# Altium schematic sheet Power_Sheet.SchDoc (part 1 of 3)
size 420 x 297 mm; SheetNumber: 2; SheetTotal: 4
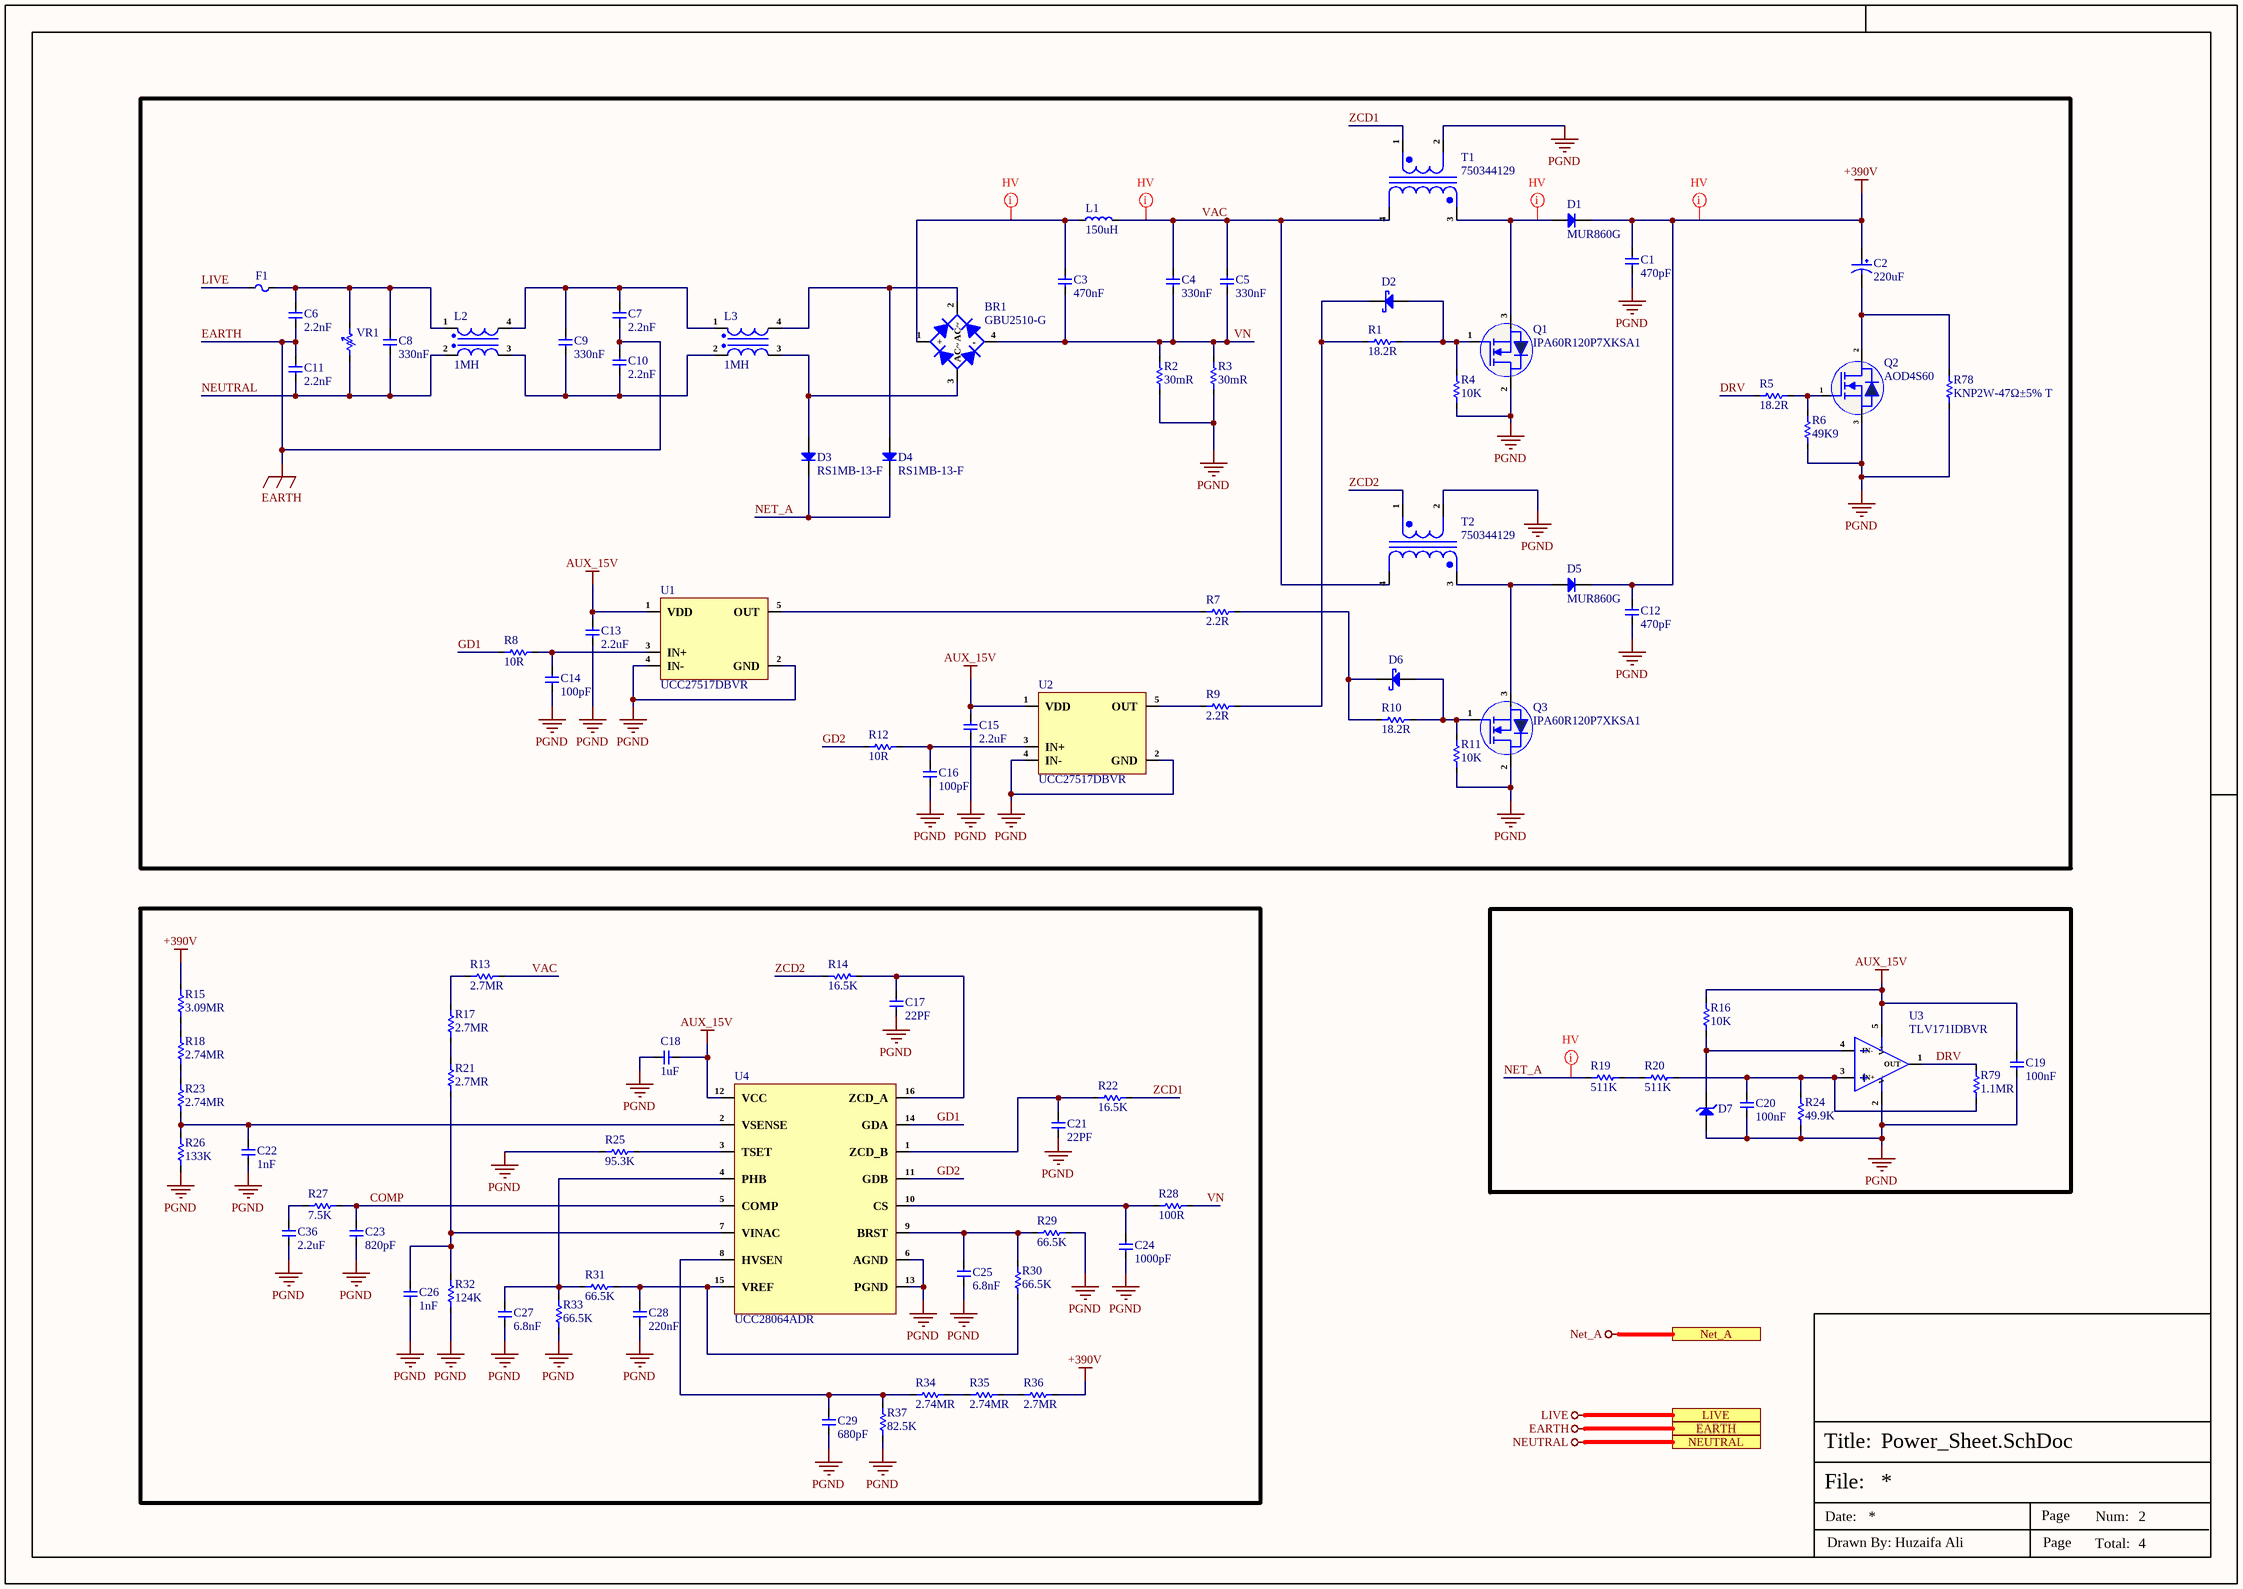
[diagram p0: Power_Sheet.SchDoc]

## Parts
BR1  GBU2510-G  [GBU]
C1  470pF  [Cap-0805]
C2  220uF
C3  470nF  [450MPK474J]
C4  330nF  [MPP334J2J15AJ22800]
C5  330nF  [MPP334J2J15AJ22800]
C6  2.2nF  [AY1222M47Y5UC63L0]
C7  2.2nF  [AY1222M47Y5UC63L0]
C8  330nF
C9  330nF
C10  2.2nF  [AY1222M47Y5UC63L0]
C11  2.2nF  [AY1222M47Y5UC63L0]
C12  470pF  [Cap-0805]
C13  2.2uF  [CAP-0603]
C14  100pF  [Cap-0402]
C15  2.2uF  [CAP-0603]
C16  100pF  [Cap-0402]
C17  22PF  [Cap-0402]
C18  1uF  [Cap-0603]
C19  100nF  [cap-0402]
C20  100nF  [cap-0402]
C21  22PF  [Cap-0402]
C22  1nF  [Cap-0402]
C23  820pF  [Cap-0603]
C24  1000pF  [Cap-0603]
C25  6.8nF  [Cap-0603]
C26  1nF  [Cap-0603]
C27  6.8nF  [Cap-0603]
C28  220nF  [Cap-1206]
C29  680pF  [Cap-0603]
C36  2.2uF  [Cap-0805]
D1  MUR860G  [TO-220-2]
D2  BAT54HT1G  [SOD-323]  (value not drawn)
D3  RS1MB-13-F  [SMB_]
D4  RS1MB-13-F  [SMB_]
D5  MUR860G  [TO-220-2]
D6  BAT54HT1G  [SOD-323]  (value not drawn)
D7  BZT52C5V1S-7-F  [SOD-323]  (value not drawn)
F1  0501010.WR1  [Fuse 1206 (3216 Metric)]  (value not drawn)
L1  150uH  [7447076]
L2  1MH  [7448031501]
L3  1MH  [7448031501]
Q1  IPA60R120P7XKSA1  [TO-220-3]
Q2  AOD4S60  [TO-252-2L]
Q3  IPA60R120P7XKSA1  [TO-220-3]
R1  18.2R  [RES-0805]
R2  30mR  [RES-2512]
R3  30mR  [RES-2512]
R4  10K  [Res-0603]
R5  18.2R  [RES-0805]
R6  49K9  [Res-0603]
R7  2.2R  [Res-0603]
R8  10R  [Res-0402]
R9  2.2R  [Res-0603]
R10  18.2R  [RES-0805]
R11  10K  [Res-0603]
R12  10R  [Res-0402]
R13  2.7MR  [Res-1206]
R14  16.5K  [Res-0603]
R15  3.09MR  [Res-1206]
R16  10K  [Res-0603]
R17  2.7MR  [Res-1206]
R18  2.74MR  [RES-0805]
R19  511K  [Res-1206]
R20  511K  [Res-1206]
R21  2.7MR  [Res-1206]
R22  16.5K  [Res-0603]
R23  2.74MR  [RES-0805]
R24  49.9K  [RES-0805]
R25  95.3K  [Res-0402]
R26  133K  [Res-0603]
R27  7.5K  [Res-0603]
R28  100R  [Res-0603]
R29  66.5K  [Res-0603]
R30  66.5K  [Res-0603]
R31  66.5K  [Res-0603]
R32  124K  [Res-0603]
R33  66.5K  [Res-0603]
R34  2.74MR  [RES-0805]
R35  2.74MR  [RES-0805]
R36  2.7MR  [Res-1206]
R37  82.5K  [Res-0603]
R78  KNP2W-47Ω±5% T  [KNP2W-47O±5]
R79  1.1MR  [Res-0603]
T1  750344129
T2  750344129
U1  UCC27517DBVR  [SOT-23-5]
U2  UCC27517DBVR  [SOT-23-5]
U3  TLV171IDBVR  [SOT-23-5]
U4  UCC28064ADR  [SOIC-16]
VR1  B72210S2271K101  [B72210S2271K101]  (value not drawn)

## Ports
EARTH (see Top_Sheet[4B], Connector_Sheet[4D]), LIVE (see Top_Sheet[4A], Connector_Sheet[4D]), Net_A (see Top_Sheet[4B], 24V_Sheet[5D]), NEUTRAL (see Top_Sheet[4A], Connector_Sheet[4D])

## Nets
+390V: C1.2 C2.1 C12.2 D1.1(K) D5.1(K) R15.2 R36.2
AUX_15V: C13.2 C15.2 C18.2 C19.2 R16.2 U1.1(VDD) U2.1(VDD) U3.5(V+) U4.12(VCC)
EARTH: C6.1 C7.1 C10.2 C11.2 ; port EARTH
LIVE: F1.1 ; port LIVE
NET_A: D3.2(K) D4.2(K) R19.1 ; port Net_A
NEUTRAL: C8.1 C11.1 L2.2 VR1.1 ; port NEUTRAL
PGND: C1.1 C12.1 C13.1 C14.1 C15.1 C16.1 C17.1 C18.1 C19.1 C20.1 C21.1 C22.1 C23.1 C24.1 C25.1 C26.1 C27.1 C28.1 C29.1 C36.1 D7.2(A) Q1.2(D) Q2.3(S) Q3.2(D) R2.1 R3.1 R4.1 R6.1 R11.1 R24.1 R25.1 R26.1 R29.2 R32.1 R33.1 R37.1 R78.1 T1.2 T2.2 U1.2(GND) U1.4(IN-) U2.2(GND) U2.4(IN-) U3.2(V-) U4.6(AGND) U4.13(PGND)
COMP: C23.2 R27.2 U4.5(COMP)
DRV: R5.1 R79.2 U3.1(OUT)
GD1: R8.1 U4.14(GDA)
GD2: R12.1 U4.11(GDB)
VAC: C4.2 C5.2 L1.2 R13.1 T1.4 T2.4
VN: BR1.4(-) C3.1 C4.1 C5.1 R2.2 R3.2 R28.2
ZCD1: R22.2 T1.1
ZCD2: R14.2 T2.1
NetBR1_1: BR1.1(+) C3.2 L1.1
NetBR1_2: BR1.2(AC~) D4.1(A) L3.4
NetBR1_3: BR1.3(AC~) D3.1(A) L3.3
NetC2_2: C2.2 Q2.2(D) R78.2
NetC6_2: C6.2 C8.2 F1.2 L2.1 VR1.2
NetC7_2: C7.2 C9.2 L2.4 L3.1
NetC9_1: C9.1 C10.1 L2.3 L3.2
NetC14_2: C14.2 R8.2 U1.3(IN+)
NetC16_2: C16.2 R12.2 U2.3(IN+)
NetC17_2: C17.2 R14.1 U4.16(ZCD_A)
NetC20_2: C20.2 R20.2 R24.2 R79.1 U3.3(IN+)
NetC21_2: C21.2 R22.1 U4.1(ZCD_B)
NetC22_2: C22.2 R23.1 R26.2 U4.2(VSENSE)
NetC24_2: C24.2 R28.1 U4.10(CS)
NetC25_2: C25.2 R29.1 R30.1 U4.9(BRST)
NetC26_2: C26.2 R21.1 R32.2 U4.7(VINAC)
NetC27_2: C27.2 R31.2 R33.2 U4.4(PHB)
NetC28_2: C28.2 R30.2 R31.1 U4.15(VREF)
NetC29_2: C29.2 R34.1 R37.2 U4.8(HVSEN)
NetC36_2: C36.2 R27.1
NetD1_2: D1.2(A) Q1.3(S) T1.3
NetD2_1: D2.1(K) R1.1 R9.2
NetD2_2: D2.2(A) Q1.1(G) R1.2 R4.2
NetD5_2: D5.2(A) Q3.3(S) T2.3
NetD6_1: D6.1(K) R7.2 R10.1
NetD6_2: D6.2(A) Q3.1(G) R10.2 R11.2
NetD7_1: D7.1(K) R16.1 U3.4(IN-)
NetQ2_1: Q2.1(G) R5.2 R6.2
NetR7_1: R7.1 U1.5(OUT)
NetR9_1: R9.1 U2.5(OUT)
NetR13_2: R13.2 R17.1
NetR15_1: R15.1 R18.2
NetR17_2: R17.2 R21.2
NetR18_1: R18.1 R23.2
NetR19_2: R19.2 R20.1
NetR25_2: R25.2 U4.3(TSET)
NetR34_2: R34.2 R35.1
NetR35_2: R35.2 R36.1

## Layout directives
mark named HV: +390V, NET_A, NetBR1_1, NetD1_2, VAC

## Notes on the sheet
- File:
- Title:
- Date:
- Page
- Num:
- Total:
- Drawn By: Huzaifa Ali